# Altium schematic sheet unused.SchDoc
size A4; SheetNumber: 2; SheetTotal: 2
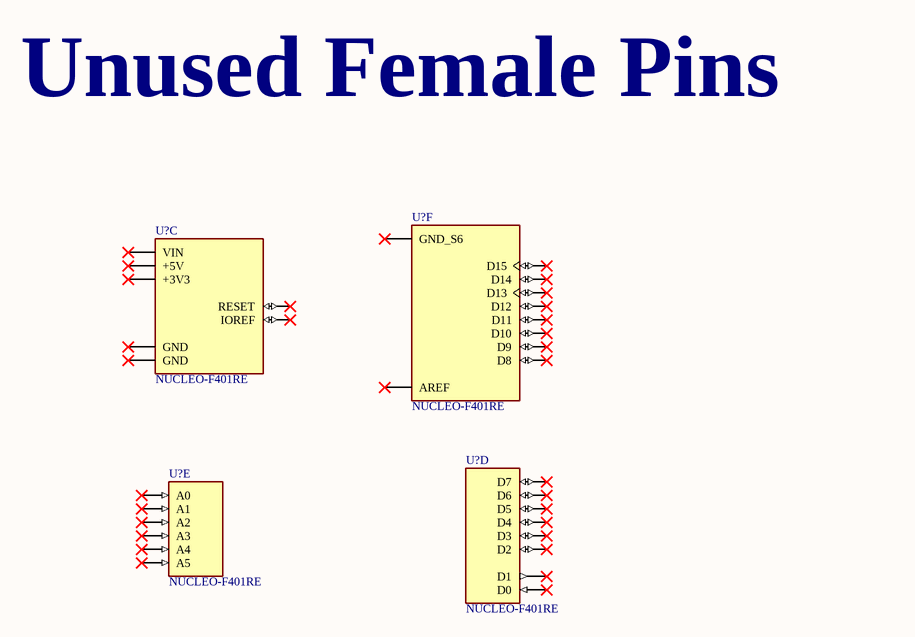
[diagram p0: unused.SchDoc]

## Parts
(Parts that share a designator on the sheet are numbered #1, #2 ... from top to bottom, then left to right.)
U?#1  NUCLEO-F401RE  [ST_NUCLEO-F401RE]  (part C of 6)
U?#2  NUCLEO-F401RE  [ST_NUCLEO-F401RE]  (part F of 6)
U?#3  NUCLEO-F401RE  [ST_NUCLEO-F401RE]  (part E of 6)
U?#4  NUCLEO-F401RE  [ST_NUCLEO-F401RE]  (part D of 6)

## Nets

Not connected (* = marked no-connect by the designer): U?#1 CN6_2(IOREF)* CN6_3(RESET)* CN6_4(+3V3)* CN6_5(+5V)* CN6_6(GND)* CN6_7(GND)* CN6_8(VIN)*; U?#2 CN5_1(D8)* CN5_2(D9)* CN5_3(D10)* CN5_4(D11)* CN5_5(D12)* CN5_6(D13)* CN5_7(GND_S6)* CN5_8(AREF)* CN5_9(D14)* CN5_10(D15)*; U?#3 CN8_1(A0)* CN8_2(A1)* CN8_3(A2)* CN8_4(A3)* CN8_5(A4)* CN8_6(A5)*; U?#4 CN9_1(D0)* CN9_2(D1)* CN9_3(D2)* CN9_4(D3)* CN9_5(D4)* CN9_6(D5)* CN9_7(D6)* CN9_8(D7)*

## Notes on the sheet
- Unused Female Pins

## Library data of the parts
U?#1-U?#4 = NUCLEO-F401RE: STM32 Nucleo-64 development board with STM32F401RET6 MCU, supports Arduino and ST morpho connectivity; Availability: Unavailable; Price: None; Package: None; MP: NUCLEO-F401RE; Value: *